# EasyEDA Pro project task1-3.eprj

# Schematic Schematic1
Board Name: Board1; Create Date: 2025-12-02; Page Name: P1; Project Name: task1-3; Schematic Name: Schematic1; Update Date: 2025-12-07; Company: 嘉立创EDA; Page Size: A4; Version: V1.0
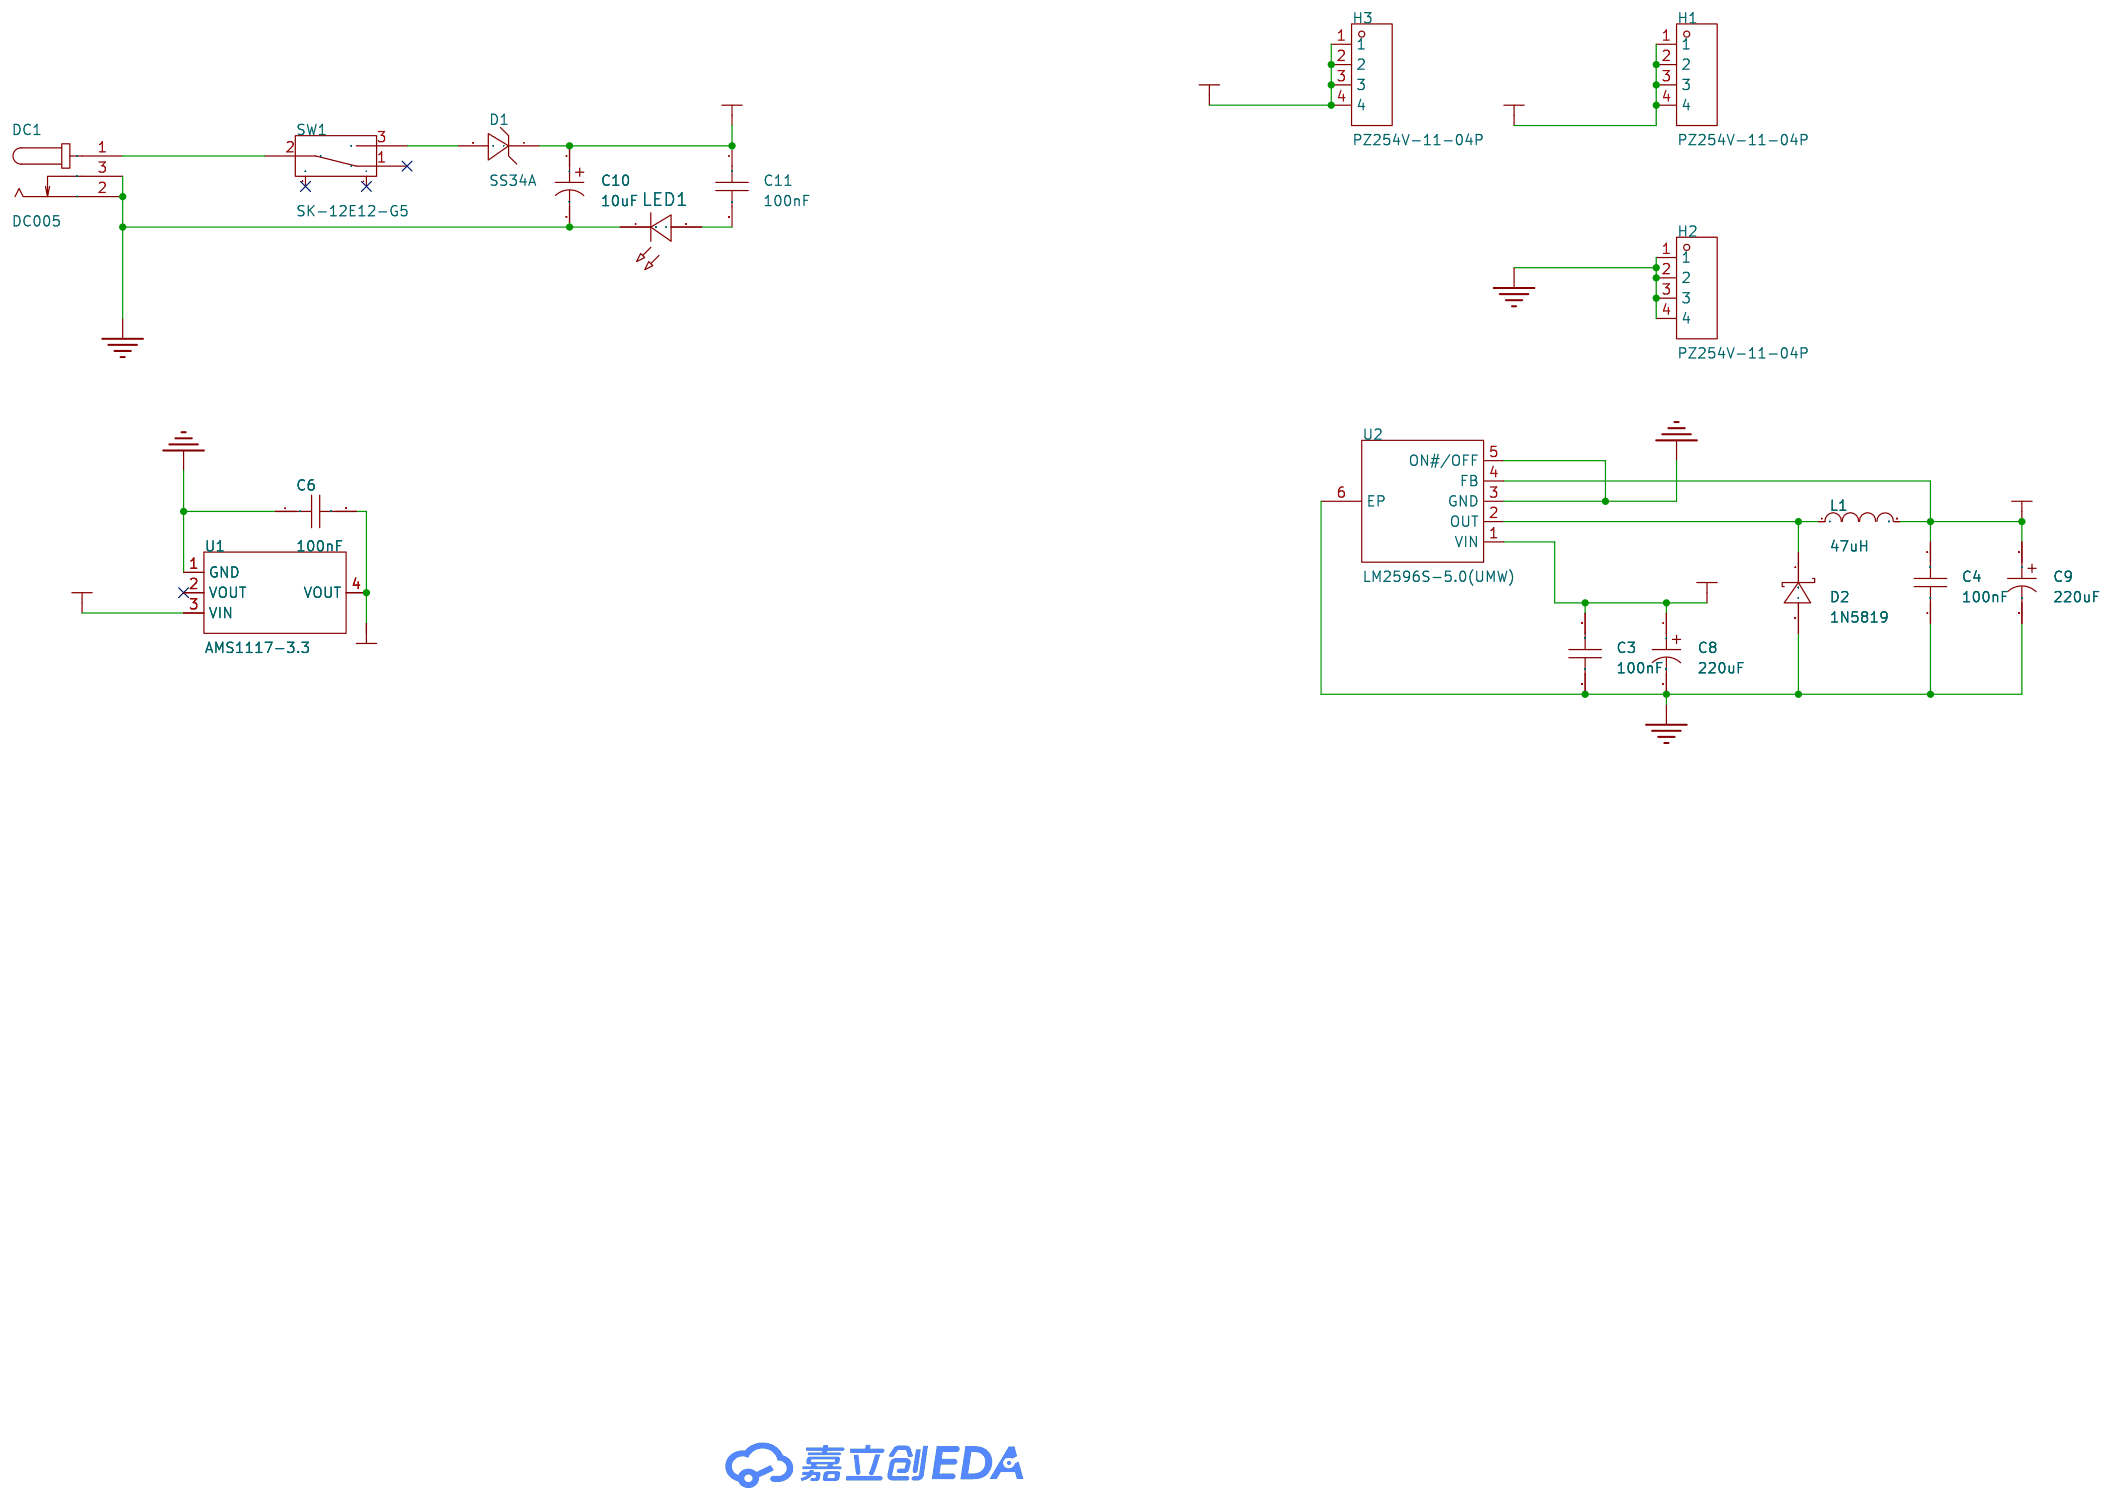
[diagram p0: schematic sheet]

## Parts
C3  100nF  [C0603]
C4  100nF  [C0603]
C6  100nF  [C0603]
C8  220uF  [CAP-TH_BD8.0-P3.50-D0.5-FD]
C9  220uF  [CAP-TH_BD8.0-P3.50-D0.5-FD]
C10  10uF  [CAP-TH_BD10.0-P5.00-D0.6-FD_1]
C11  100nF  [C0603]
D1  SS34A  [SMA_L4.4-W2.6-LS5.1-RD]
D2  1N5819  [SMA_L4.4-W2.6-LS5.0-RD]
DC1  DC005  [DC-IN-TH_DC005]
H1  PZ254V-11-04P  [HDR-TH_4P-P2.54-V-M]
H2  PZ254V-11-04P  [HDR-TH_4P-P2.54-V-M]
H3  PZ254V-11-04P  [HDR-TH_4P-P2.54-V-M]
L1  47uH  [L0603]
LED1  -  [LED_0603]
SW1  SK-12E12-G5  [SW-TH_SK-12E12-G5]
U1  AMS1117-3.3  [SOT-223-3_L6.5-W3.4-P2.30-LS7.0-BR]
U2  LM2596S-5.0(UMW)  [TO-263-5_L10.2-W8.9-P1.70-BR]

## Library data of the parts
C3 C4 C6 C11 = CAP_0603: Supplier Footprint: 0603
C8 C9 = ERA35V220M8X12: LCSC Part Name: 220uF ±20% 35V; Supplier Part: C49256804; Manufacturer: JIERR(捷而瑞); Supplier Footprint: 插件,D8xL12mm; JLCPCB Part Class: 扩展库; Datasheet: https://item.szlcsc.com/datasheet/ERA35V220M8X12/51692204.html; Supplier: LCSC; Tolerance: ±20%; Voltage Rating: 35V; Pin Spacing: 3.5mm; Diameter: 8mm; Height - Seated (Max): 12mm; Lifetime: 2000hrs@105℃; Operating Temperature: -40℃~+105℃
C10 = ERG450V10M10x16: LCSC Part Name: 10uF ±20% 450V; Supplier Part: C46552835; Manufacturer: JIERR(捷而瑞); Supplier Footprint: 插件,D10xL16mm; JLCPCB Part Class: 扩展库; Datasheet: https://item.szlcsc.com/datasheet/ERG450V10M10x16/48687203.html; Supplier: LCSC; Tolerance: ±20%; Voltage Rating: 450V; Ripple Current: 100mA@100kHz; Equivalent Series Resistance(ESR): 9.45Ω@100kHz; Pin Spacing: 5mm; Diameter: 10mm; Height - Seated (Max): 16mm; Lifetime: 2000hrs@105℃; Operating Temperature: -25℃~+105℃
D1 = SS34A_C2886580: LCSC Part Name: 电压:40V 电流:3A; Supplier Part: C2886580; Manufacturer: Hottech(合科泰); Supplier Footprint: SMA(DO-214AC); JLCPCB Part Class: 扩展库; Datasheet: https://item.szlcsc.com/datasheet/SS34A/3101200.html; Supplier: LCSC; Diode Configuration: 独立式; Voltage - Forward(Vf@If): 500mV@3A; Voltage - DC Reverse(Vr): 40V; Current - Rectified: 3A; Reverse Leakage Current (Ir): 500uA@40V; Non-Repetitive Peak Forward Surge Current: 80A
D2 = 1N5819_C437199: LCSC Part Name: KEXIN(科信)原型号 SS14,后续变更为 1N5819，丝印不变。 电压:40V 电流:1A; Supplier Part: C437199; Manufacturer: KEXIN(科信); Supplier Footprint: DO-214AC(SMA); JLCPCB Part Class: 扩展库; Datasheet: https://item.szlcsc.com/datasheet/1N5819/435098.html; Supplier: LCSC; Voltage - Forward(Vf@If): 500mV@1A; Voltage - DC Reverse(Vr): 40V; Current - Rectified: 1A; Operating Junction Temperature Range: -60℃~+125℃; Non-Repetitive Peak Forward Surge Current: 40A
DC1 = DC005: LCSC Part Name: DC电源插座 内径:2mm 外径:6.3mm; Supplier Part: C431533; Manufacturer: SHOU HAN(首韩); Supplier Footprint: 插件; JLCPCB Part Class: 扩展库; Datasheet: https://item.szlcsc.com/datasheet/DC005/427890.html; Supplier: LCSC; Connector Type: DC电源插座; Mounting Type: 弯插; Inside Contact Diameter: 2mm; Outside Contact Diameter: 6.3mm; Current Rating: 500mA; Voltage Rating (Max): 12V; Operating Temperature: -30℃~+70℃
H1-H3 = PZ254V-11-04P: LCSC Part Name: 1x4P 间距:2.54mm 方针 直插; Supplier Part: C2691448; Manufacturer: XFCN(兴飞); Supplier Footprint: 插件,P=2.54mm; JLCPCB Part Class: 扩展库; Datasheet: https://item.szlcsc.com/datasheet/PZ254V-11-04P/2801085.html; Supplier: LCSC; Pin Structure: 1x4P; Pitch: 2.54mm; Circluar Pins/Square Pins: 方针; Mounting Type: 直插; Number of Rows: 单排; Number of Pins: 4P; Current Rating: 3A; Voltage Rating (Max): 250V; Length of Mating Pin: 6mm; Insulation Height: 2.5mm; Length of End Connection Pin: 3mm; Operating Temperature: -40℃~+105℃; Color: 黑色
L1 = L_0603
LED1 = LED_0603-R: Supplier Footprint: 0603
SW1 = SK-12E12-G5: LCSC Part Name: 卧插双档 滑动开关; Supplier Part: C136720; Manufacturer: 韩国韩荣; Supplier Footprint: 插件; JLCPCB Part Class: 扩展库; Datasheet: https://item.szlcsc.com/datasheet/SK-12E12-G5/148036.html; Supplier: LCSC; Circuit: 单刀双掷; Actuator Style: 矩形柱状; Termination Style: PC引脚; Switch Height: 10.6mm; Life: 5千次; Operating Temperature: -25℃~+70℃
U1 = AMS1117-3.3_C6186: LCSC Part Name: 输出3.3V 1A; Supplier Part: C6186; Manufacturer: AMS; Supplier Footprint: SOT-223; JLCPCB Part Class: 基础库; Datasheet: https://item.szlcsc.com/datasheet/AMS1117-3.3/6652.html; Supplier: LCSC; Output Type: 固定; Voltage - Supply: 16V; Output Voltage: 3.3V; Output Current: 1A; Power Supply Rejection Ratio (PSRR): 72dB@(120Hz); Voltage Dropout: 1.1V@(800mA); standby current: 5mA; Noise: 0.003%Vout; Features: 过流保护；过热保护; Operating Temperature: -40℃~+125℃; Output Configuration: 正极; Number of Outputs: 1
U2 = LM2596S-5.0(UMW): LCSC Part Name: 3A降压稳压器; Supplier Part: C347421; Manufacturer: UMW(友台半导体); Supplier Footprint: TO-263-5; JLCPCB Part Class: 扩展库; Datasheet: https://item.szlcsc.com/datasheet/LM2596S-5.0(UMW)/324081.html; Supplier: LCSC; Function: 降压型; Voltage - Supply: 7V~40V; Output Voltage: 5V; Output Current: 3A; Frequency - Switching: 150kHz; Operating Temperature: -40℃~+125℃@(TA); Synchronous Rectifier: 否; Number of Outputs: 1; Topology: 降压式; Quiescent Current: 80uA; Switch tube (built-in/external): 内置; Output Type: 固定

## Nets
12V: C3.2 C8.1 C10.1 C11.1 D1.1 U1.3(VIN) U2.1(VIN)
GND: C3.1 C4.1 C6.1 C8.2 C9.2 C10.2 D2.2(A) DC1.2 DC1.3 H2.1 H2.2 H2.3 H2.4 LED1.1(C) U1.1(GND) U2.3(GND) U2.5(ON#/OFF) U2.6(EP)
3.3: C6.2 H3.1 H3.2 H3.3 H3.4 U1.4(VOUT)
VOUT: C4.2 C9.1 H1.1 H1.2 H1.3 H1.4 L1.2 U2.4(FB)
$1N282: DC1.1 SW1.2
$1N361: D1.2 SW1.3
$1N638: C11.2 LED1.2(A)
$1N1721: D2.1(C) L1.1 U2.2(OUT)

Not connected (* = marked no-connect by the designer): SW1 1* 4* 5*; U1 2(VOUT)*

# Board PCB1
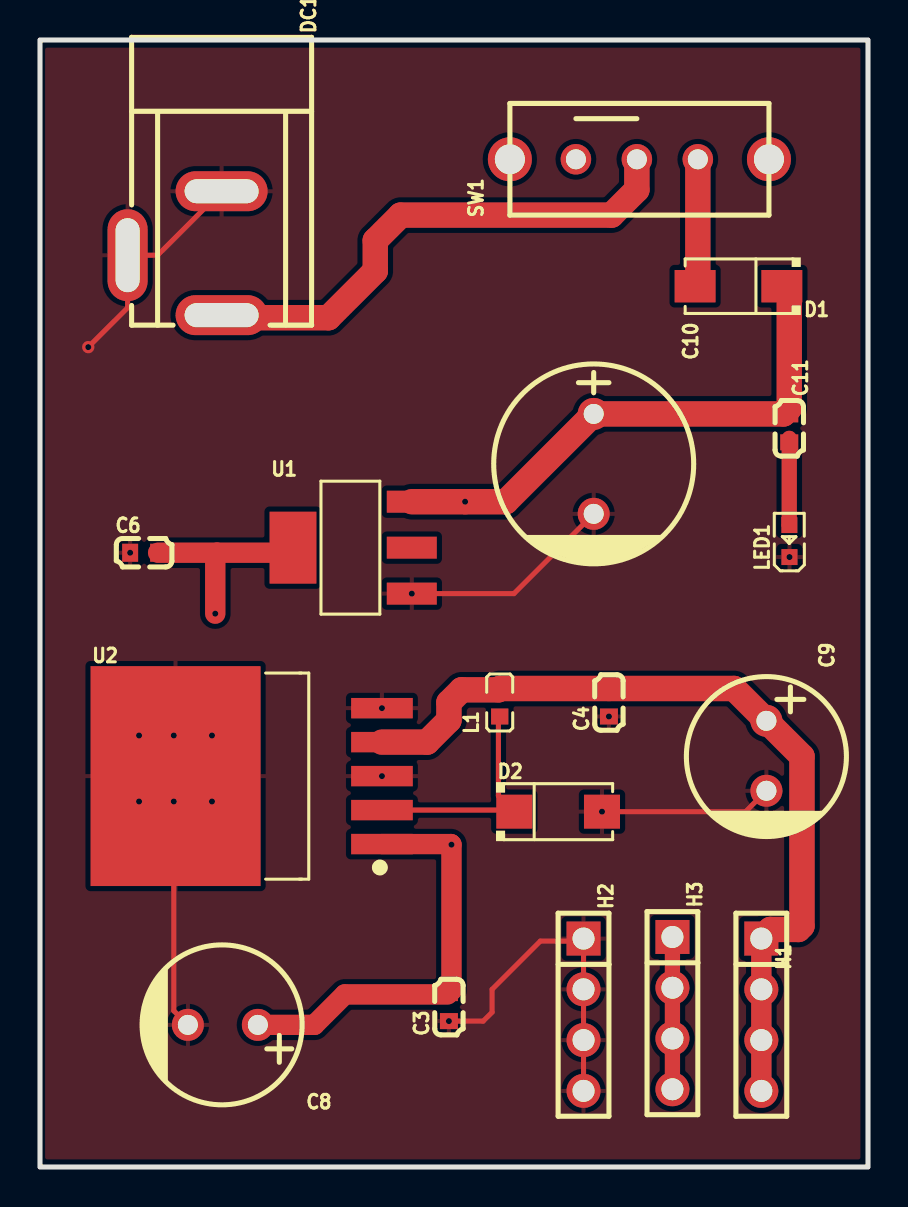
[diagram p1: board, top side]
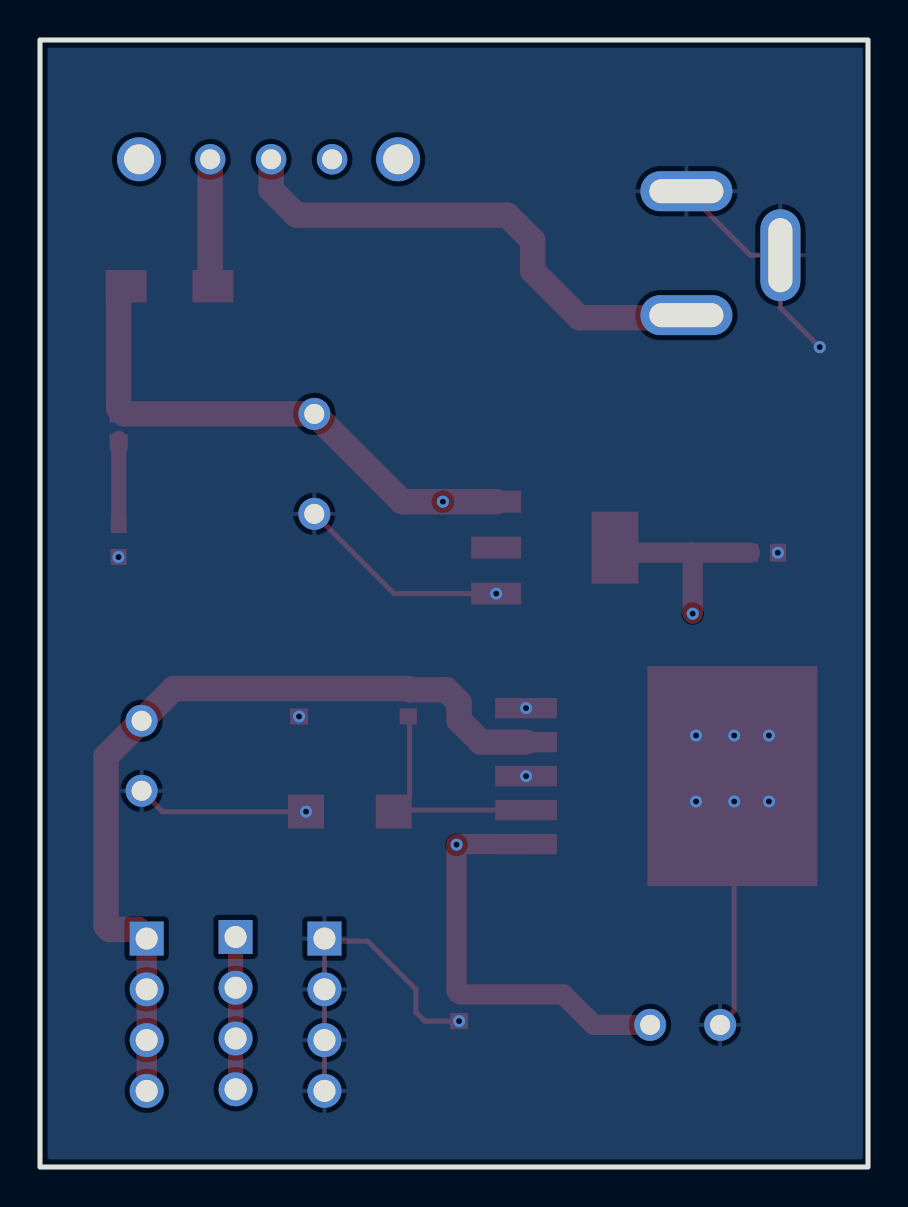
[diagram p2: board, bottom side, seen from below]

Outline 41.4 x 56.39 mm; copper layers: Top Layer, GND, 电源, Bottom Layer. Coordinates in mm from the lower left corner of the outline.
Outline path: rectangle 0,56.39 41.4,0
Stack: Top Layer 0.035mm 外层铜厚1oz / Dielectric1 0.2104mm 7628 RC49% 8.6mil / GND 0.0152mm 内层铜厚 / Dielectric2 1.065mm 1.1mm H/HOZ Copper / 电源 0.0152mm 内层铜厚 / Dielectric3 0.2104mm 7628 RC49% 8.6mil / Bottom Layer 0.035mm 外层铜厚1oz

## Design rules (mm)
template: JLCPCB Capability(Two Layers Board)
spacing copperThickness1oz (default): track to track 0.102, other pairs 0.152 to 0.3
spacing copperThickness2oz: track to track 0.203, other pairs 0.152 to 0.3
track width copperThickness1oz (default): min 0.127, default 0.254, max 2.54
track width copperThickness2oz: min 0.203, default 0.254, max 2.54
differential pair differentialPair (default): width min 0.127, default 0.254, max 2.54; gap min 0.152, default 0.152
via viaSize (default): diameter min 0.5, default 0.61, max 10; hole min 0.3, default 0.305, max 6.3

## Placement (name value [footprint] x y rotation side)
C3  100nF  [C0603]  20.45 8 90 top
C4  100nF  [C0603]  28.45 23.24 90 top
C6  100nF  [C0603]  5.21 30.73 0 top
C8  220uF  [CAP-TH_BD8.0-P3.50-D0.5-FD]  9.14 7.11 180 top
C9  220uF  [CAP-TH_BD8.0-P3.50-D0.5-FD]  36.32 20.57 270 top
C10  10uF  [CAP-TH_BD10.0-P5.00-D0.6-FD_1]  27.69 35.18 270 top
C11  100nF  [C0603]  37.47 36.96 270 top
D1  SS34A  [SMA_L4.4-W2.6-LS5.1-RD]  34.92 44.07 180 top
D2  1N5819  [SMA_L4.4-W2.6-LS5.0-RD]  25.91 17.78 0 top
DC1  DC005  [DC-IN-TH_DC005]  6.73 45.72 270 top
H1  PZ254V-11-04P  [HDR-TH_4P-P2.54-V-M]  36.07 7.62 270 top
H2  PZ254V-11-04P  [HDR-TH_4P-P2.54-V-M]  27.18 7.62 270 top
H3  PZ254V-11-04P  [HDR-TH_4P-P2.54-V-M]  31.62 7.7 270 top
L1  47uH  [L0603]  22.99 23.24 90 top
LED1  -  [LED_0603]  37.47 31.37 90 top
SW1  SK-12E12-G5  [SW-TH_SK-12E12-G5]  29.97 50.42 90 top
U1  AMS1117-3.3  [SOT-223-3_L6.5-W3.4-P2.30-LS7.0-BR]  15.62 30.99 0 top
U2  LM2596S-5.0(UMW)  [TO-263-5_L10.2-W8.9-P1.70-BR]  11.94 19.56 0 top

## Footprints (pads in the part's own frame, mm; a bottom-side part is the same pattern mirrored in y, then rotated)
C0603
  rect 0.8x0.9 smd: 1(-0.7,0) 2(0.7,0)
CAP-TH_BD8.0-P3.50-D0.5-FD
  round 1.6 hole 1: 1(-1.75,0) 2(1.75,0)
CAP-TH_BD10.0-P5.00-D0.6-FD_1
  round 1.6 hole 1: 1(-2.5,0) 2(2.5,0)
DC-IN-TH_DC005
  oval 2x4.6 hole 1.2x3.7: 1(3.1,2.35) 2(-3.1,2.35)
  oval 4.6x2 hole 3.7x1.2: 3(0.1,-2.35)
HDR-TH_4P-P2.54-V-M
  rect 1.7x1.7 hole 1.1: 1(-3.81,0)
  round 1.7 hole 1.1: 2(-1.27,0) 3(1.27,0) 4(3.81,0)
L0603
  rect 0.8x0.864 smd: 1(-0.7,0) 2(0.7,0)
LED_0603
  rect 0.8x0.8 smd: 1(-0.851,-0.01) 2(0.75,-0.005)
SMA_L4.4-W2.6-LS5.0-RD
  rect 1.8x1.7 smd: 1(-2.192,0) 2(2.192,0)
SMA_L4.4-W2.6-LS5.1-RD
  rect 2.046x1.62 smd: 1(-2.169,0) 2(2.169,0)
SOT-223-3_L6.5-W3.4-P2.30-LS7.0-BR
  rect 2.5x1.1 smd: 1(2.97,-2.3) 2(2.97,0) 3(2.97,2.3)
  rect 2.34x3.6 smd: 4(-2.97,0)
SW-TH_SK-12E12-G5
  round 1.524 hole 1: 1(0,3.175) 2(0,0.127) 3(0,-2.921)
  round 2.2 hole 1.5: 4(0,-6.477) 5(0,6.477)
TO-263-5_L10.2-W8.9-P1.70-BR
  rect 3.083x1.02 smd: 1(5.16,-3.4) 2(5.16,-1.7) 3(5.16,0) 4(5.16,1.7) 5(5.16,3.4)
  rect 8.5x11 smd: 6(-5.16,0)

## Nets
As in the schematic.

Pads without a net: SW1 1 4 5; U1 2

## Via types
v1: diameter 0.61, hole 0.305, Top Layer to Bottom Layer, 18 vias

## Routing (per net, layer and track width the routed paths; a pad name or vN(x,y) marks a point on that pad's centre or on a via; arc(x,y) is an arc through that point)
12V: length 48.2
  Top Layer w1.016: C8.1 13.72,7.11 15.24,8.64 20.38,8.64 ; U2.1 20.54,16.16 v1(20.57,16.13) 20.57,8.83 C3.2
  Top Layer w1.27: D1.1 37.47,43.7 37.47,37.96 37.18,37.68 C10.1 23.29,33.29 v1(21.26,33.29) U1.3
GND: length 59
  Top Layer w0.254: H2.4 H2.3 H2.2 H2.1 27.05,11.3 25.02,11.3 22.61,8.89 22.61,7.75 22.16,7.3 v1(20.45,7.3) ; C8.2 6.69,7.81 v1(6.69,18.29) ; v1(28.1,17.78) 35.28,17.78 C9.2 ; DC1.2 5.88,45.62 DC1.3 4.38,42.99 v1(2.41,41.02) ; v1(18.59,28.69) 23.69,28.69 C10.2
  vias: v1(4.51,30.73) v1(4.95,21.59) v1(4.95,18.29) v1(6.69,21.59) v1(8.6,21.59) v1(8.6,18.29) v1(17.1,22.96) v1(17.1,19.56) v1(28.45,22.54) v1(37.48,30.52)
3.3: length 61
  Top Layer w0.762: H3.1 H3.2 H3.3 H3.4
  Top Layer w1.016: v1(8.76,27.69) 8.76,30.65 8.85,30.73 ; 8.85,30.73 12.4,30.73 U1.4 ; 8.85,30.73 C6.2
  电源 w0.508: v1(8.76,27.69) 11.05,25.4 11.05,11.05 12.83,9.27 22.1,9.27 27.18,14.35 30.99,14.35 31.62,13.72 H3.1
VOUT: length 42.4
  Top Layer w1.016: H1.1 H1.2 H1.3 H1.4
  Top Layer w1.27: U2.4 19.35,21.26 20.45,22.35 20.45,23.24 21.08,23.88 22.92,23.88 L1.2 C4.2 34.7,23.94 C9.1 38.1,20.55 38.1,12.07 37.92,11.89 36.52,11.89 H1.1
$1N282: length 25.7
  Top Layer w1.27: SW1.2 29.84,48.9 28.57,47.62 18.03,47.62 16.76,46.36 16.76,44.83 14.43,42.49 9.21,42.49
$1N361: length 6.4
  Top Layer w1.27: SW1.3 32.89,44.21 32.76,44.07
$1N638: length 4.3
  Top Layer w0.762: 37.47,36.46 37.47,32.12 LED1.2
$1N1721: length 11.7
  Top Layer w0.254: 22.92,22.61 22.92,18.57 23.64,17.86 ; 23.64,17.86 D2.1 ; 23.64,17.86 U2.2

## Copper pours and planes (outline as drawn; the poured copper is in the pictures)
12V on 电源: 14.1,36.58 25.4,36.58 25.4,14.1 14.1,14.1
GND on Top Layer: 0.13,56.01 41.02,56.01 41.02,0.38 0.13,0.38
GND on Bottom Layer: 0.13,56.01 41.02,56.01 41.02,0.38 0.13,0.38
GND on GND: 0,55.99 40.51,55.99 40.51,0.51 0,0.51
